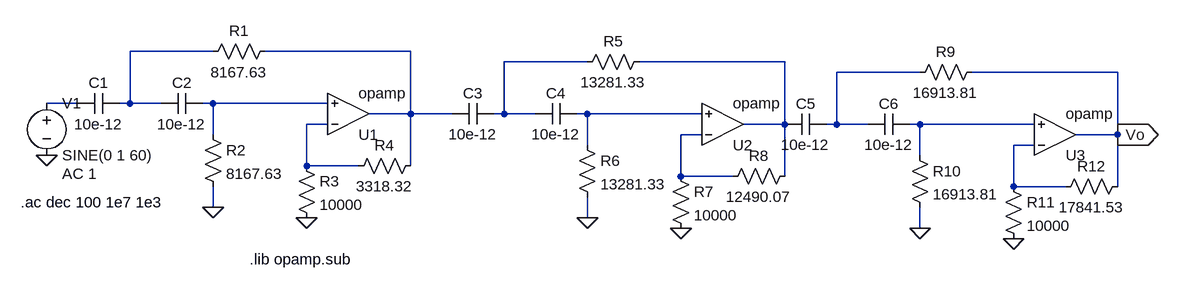
[diagram p0: schematic Circuito.asc]
Circuito.asc, the LTspice schematic file:
Version 4
SHEET 1 1832 680
WIRE 352 -16 224 -16
WIRE 656 -16 432 -16
WIRE 928 0 800 0
WIRE 1232 0 1008 0
WIRE 1440 16 1312 16
WIRE 1744 16 1520 16
WIRE 144 64 96 64
WIRE 224 64 224 -16
WIRE 224 64 208 64
WIRE 272 64 224 64
WIRE 352 64 336 64
WIRE 528 64 352 64
WIRE 656 80 656 -16
WIRE 656 80 592 80
WIRE 720 80 656 80
WIRE 800 80 800 0
WIRE 800 80 784 80
WIRE 848 80 800 80
WIRE 928 80 912 80
WIRE 1104 80 928 80
WIRE 528 96 496 96
WIRE 1232 96 1232 0
WIRE 1232 96 1168 96
WIRE 1312 96 1312 16
WIRE 1312 96 1296 96
WIRE 1360 96 1312 96
WIRE 1440 96 1424 96
WIRE 1616 96 1440 96
WIRE 352 112 352 64
WIRE 1104 112 1072 112
WIRE 1744 112 1744 16
WIRE 1744 112 1680 112
WIRE 928 128 928 80
WIRE 1616 128 1584 128
WIRE 1440 144 1440 96
WIRE 496 160 496 96
WIRE 576 160 496 160
WIRE 656 160 656 80
WIRE 1072 176 1072 112
WIRE 1152 176 1072 176
WIRE 1232 176 1232 96
WIRE 1584 192 1584 128
WIRE 1664 192 1584 192
WIRE 1744 192 1744 112
WIRE 352 224 352 192
WIRE 928 240 928 208
WIRE 1440 256 1440 224
FLAG 352 224 0
FLAG 1744 112 Vo
IOPIN 1744 112 Out
FLAG 96 144 0
FLAG 496 240 0
FLAG 928 240 0
FLAG 1072 256 0
FLAG 1440 256 0
FLAG 1584 272 0
SYMBOL voltage 96 48 R0
WINDOW 123 24 124 Left 2
WINDOW 39 0 0 Left 0
SYMATTR Value2 AC 1
SYMATTR InstName V1
SYMATTR Value SINE(0 1 60)
SYMBOL cap 208 48 R90
WINDOW 0 0 32 VBottom 2
WINDOW 3 32 32 VTop 2
SYMATTR InstName C1
SYMATTR Value 10e-12
SYMBOL cap 336 48 R90
WINDOW 0 0 32 VBottom 2
WINDOW 3 32 32 VTop 2
SYMATTR InstName C2
SYMATTR Value 10e-12
SYMBOL res 448 -32 R90
WINDOW 0 0 56 VBottom 2
WINDOW 3 32 56 VTop 2
SYMATTR InstName R1
SYMATTR Value 8167.63
SYMBOL res 336 96 R0
SYMATTR InstName R2
SYMATTR Value 8167.63
SYMBOL Opamps\\opamp 560 144 M180
SYMATTR InstName U1
SYMATTR SpiceLine2 GBW=100G
SYMBOL res 480 144 R0
SYMATTR InstName R3
SYMATTR Value 10000
SYMBOL res 672 144 R90
WINDOW 0 0 56 VBottom 2
WINDOW 3 32 56 VTop 2
SYMATTR InstName R4
SYMATTR Value 3318.32
SYMBOL cap 784 64 R90
WINDOW 0 0 32 VBottom 2
WINDOW 3 32 32 VTop 2
SYMATTR InstName C3
SYMATTR Value 10e-12
SYMBOL cap 912 64 R90
WINDOW 0 0 32 VBottom 2
WINDOW 3 32 32 VTop 2
SYMATTR InstName C4
SYMATTR Value 10e-12
SYMBOL res 1024 -16 R90
WINDOW 0 0 56 VBottom 2
WINDOW 3 32 56 VTop 2
SYMATTR InstName R5
SYMATTR Value 13281.33
SYMBOL res 912 112 R0
SYMATTR InstName R6
SYMATTR Value 13281.33
SYMBOL Opamps\\opamp 1136 160 M180
SYMATTR InstName U2
SYMATTR SpiceLine2 GBW=100G
SYMBOL res 1056 160 R0
SYMATTR InstName R7
SYMATTR Value 10000
SYMBOL res 1248 160 R90
WINDOW 0 0 56 VBottom 2
WINDOW 3 32 56 VTop 2
SYMATTR InstName R8
SYMATTR Value 12490.07
SYMBOL cap 1296 80 R90
WINDOW 0 0 32 VBottom 2
WINDOW 3 32 32 VTop 2
SYMATTR InstName C5
SYMATTR Value 10e-12
SYMBOL cap 1424 80 R90
WINDOW 0 0 32 VBottom 2
WINDOW 3 32 32 VTop 2
SYMATTR InstName C6
SYMATTR Value 10e-12
SYMBOL res 1536 0 R90
WINDOW 0 0 56 VBottom 2
WINDOW 3 32 56 VTop 2
SYMATTR InstName R9
SYMATTR Value 16913.81
SYMBOL res 1424 128 R0
SYMATTR InstName R10
SYMATTR Value 16913.81
SYMBOL Opamps\\opamp 1648 176 M180
SYMATTR InstName U3
SYMATTR SpiceLine2 GBW=100G
SYMBOL res 1568 176 R0
SYMATTR InstName R11
SYMATTR Value 10000
SYMBOL res 1760 176 R90
WINDOW 0 0 56 VBottom 2
WINDOW 3 32 56 VTop 2
SYMATTR InstName R12
SYMATTR Value 17841.53
TEXT 56 216 Left 2 !.ac dec 100 1e7 1e3
TEXT 408 304 Left 2 !.lib opamp.sub

The netlist it stands for:
* Circuito.asc
V1 N006 0 SINE(0 1 60) AC 1
C1 N001 N006 10e-12
C2 N007 N001 10e-12
R1 N002 N001 8167.63
R2 N007 0 8167.63
XU1 N009 N007 N002 opamp Aol=100K GBW=100G  ; pins invin noninvin out
R3 N009 0 10000
R4 N002 N009 3318.32
C3 N003 N002 10e-12
C4 N008 N003 10e-12
R5 N004 N003 13281.33
R6 N008 0 13281.33
XU2 N011 N008 N004 opamp Aol=100K GBW=100G  ; pins invin noninvin out
R7 N011 0 10000
R8 N004 N011 12490.07
C5 N005 N004 10e-12
C6 N010 N005 10e-12
R9 Vo N005 16913.81
R10 N010 0 16913.81
XU3 N012 N010 Vo opamp Aol=100K GBW=100G  ; pins invin noninvin out
R11 N012 0 10000
R12 Vo N012 17841.53
.ac dec 100 1e7 1e3
.lib opamp.sub
.backanno
.end